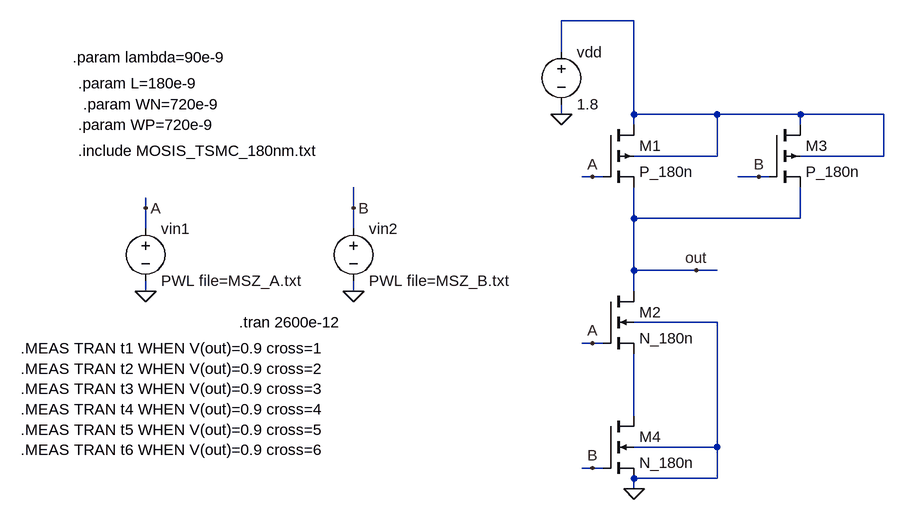
[diagram p0: schematic nand.asc]
nand.asc, the LTspice schematic file:
Version 4
SHEET 1 964 680
WIRE 576 -128 464 -128
WIRE 464 -80 464 -128
WIRE 464 16 464 0
WIRE 576 16 576 -128
WIRE 704 16 576 16
WIRE 832 16 704 16
WIRE 960 16 832 16
WIRE 576 32 576 16
WIRE 832 32 832 16
WIRE 704 80 704 16
WIRE 704 80 576 80
WIRE 960 80 960 16
WIRE 960 80 832 80
WIRE 512 112 496 112
WIRE 528 112 512 112
WIRE 768 112 736 112
WIRE 784 112 768 112
WIRE -176 160 -176 144
WIRE 144 160 144 128
WIRE 576 176 576 128
WIRE 832 176 832 128
WIRE 832 176 576 176
WIRE -176 192 -176 160
WIRE 144 192 144 160
WIRE 576 256 576 176
WIRE 672 256 576 256
WIRE 704 256 672 256
WIRE -176 288 -176 272
WIRE 144 288 144 272
WIRE 576 288 576 256
WIRE 704 336 576 336
WIRE 512 368 496 368
WIRE 528 368 512 368
WIRE 576 480 576 384
WIRE 704 528 704 336
WIRE 704 528 576 528
WIRE 512 560 496 560
WIRE 528 560 512 560
WIRE 704 576 704 528
WIRE 704 576 576 576
WIRE 576 592 576 576
FLAG 576 592 0
FLAG 464 16 0
FLAG -176 288 0
FLAG 144 288 0
FLAG -176 160 A
FLAG 512 112 A
FLAG 512 368 A
FLAG 144 160 B
FLAG 768 112 B
FLAG 512 560 B
FLAG 672 256 out
SYMBOL pmos4 528 32 R0
SYMATTR InstName M1
SYMATTR Value P_180n
SYMATTR Value2 l={L} w={WP} ad={WP*5*lambda} as={WP*5*lambda} pd={2*WP+10*lambda} ps={2*WP+10*lambda}
SYMBOL nmos4 528 288 R0
SYMATTR InstName M2
SYMATTR Value N_180n
SYMATTR Value2 l={L} w={WN} ad={WN*5*lambda} as={WN*5*lambda} pd={2*WN+10*lambda} ps={2*WN+10*lambda}
SYMBOL voltage 464 -96 R0
SYMATTR InstName vdd
SYMATTR Value 1.8
SYMBOL pmos4 784 32 R0
SYMATTR InstName M3
SYMATTR Value P_180n
SYMATTR Value2 l={L} w={WP} ad={WP*5*lambda} as={WP*5*lambda} pd={2*WP+10*lambda} ps={2*WP+10*lambda}
SYMBOL nmos4 528 480 R0
SYMATTR InstName M4
SYMATTR Value N_180n
SYMATTR Value2 l={L} w={WN} ad={WN*5*lambda} as={WN*5*lambda} pd={2*WN+10*lambda} ps={2*WN+10*lambda}
SYMBOL voltage -176 176 R0
WINDOW 123 0 0 Left 0
WINDOW 39 0 0 Left 0
SYMATTR InstName vin1
SYMATTR Value PWL file=MSZ_A.txt
SYMBOL voltage 144 176 R0
WINDOW 123 0 0 Left 0
WINDOW 39 0 0 Left 0
SYMATTR InstName vin2
SYMATTR Value PWL file=MSZ_B.txt
TEXT -288 -72 Left 2 !.param lambda=90e-9
TEXT -280 -32 Left 2 !.param L=180e-9
TEXT -272 0 Left 2 !.param WN=720e-9
TEXT -280 32 Left 2 !.param WP=720e-9
TEXT -32 336 Left 2 !.tran 2600e-12
TEXT -280 72 Left 2 !.include MOSIS_TSMC_180nm.txt
TEXT -368 376 Left 2 !.MEAS TRAN t1 WHEN V(out)=0.9 cross=1\n.MEAS TRAN t2 WHEN V(out)=0.9 cross=2\n.MEAS TRAN t3 WHEN V(out)=0.9 cross=3\n.MEAS TRAN t4 WHEN V(out)=0.9 cross=4\n.MEAS TRAN t5 WHEN V(out)=0.9 cross=5\n.MEAS TRAN t6 WHEN V(out)=0.9 cross=6

The netlist it stands for:
* nand.asc
M1 N001 A out N001 P_180n l={L} w={WP} ad={WP*5*lambda} as={WP*5*lambda} pd={2*WP+10*lambda} ps={2*WP+10*lambda}
M2 out A N002 0 N_180n l={L} w={WN} ad={WN*5*lambda} as={WN*5*lambda} pd={2*WN+10*lambda} ps={2*WN+10*lambda}
vdd N001 0 1.8
M3 N001 B out N001 P_180n l={L} w={WP} ad={WP*5*lambda} as={WP*5*lambda} pd={2*WP+10*lambda} ps={2*WP+10*lambda}
M4 N002 B 0 0 N_180n l={L} w={WN} ad={WN*5*lambda} as={WN*5*lambda} pd={2*WN+10*lambda} ps={2*WN+10*lambda}
vin1 A 0 PWL file=MSZ_A.txt
vin2 B 0 PWL file=MSZ_B.txt
.model NMOS NMOS
.model PMOS PMOS
.lib standard.mos
.param lambda=90e-9
.param L=180e-9
.param WN=720e-9
.param WP=720e-9
.tran 2600e-12
.include MOSIS_TSMC_180nm.txt
.MEAS TRAN t1 WHEN V(out)=0.9 cross=1
.MEAS TRAN t2 WHEN V(out)=0.9 cross=2
.MEAS TRAN t3 WHEN V(out)=0.9 cross=3
.MEAS TRAN t4 WHEN V(out)=0.9 cross=4
.MEAS TRAN t5 WHEN V(out)=0.9 cross=5
.MEAS TRAN t6 WHEN V(out)=0.9 cross=6
.backanno
.end